# Altium schematic sheet as14120_ddr.SchDoc
size A3; PageSetup: Record=PageOptions|CenterHorizontal=True|CenterVertical=True|PrintScale=1.56|XCorrection=1.00|YCorrection=1.00|PrintKind=0|BorderSize=5000000|LeftOffset=0|BottomOffset=0|Orientation=2|PaperLength=3060|PaperWidth=2190|Scale=100|PaperSource=7|PrintQuality=-4|MediaType=1|DitherType=10|PaperKind=A4 (без полей) (210 x 297 мм)|PrintScaleMode=1
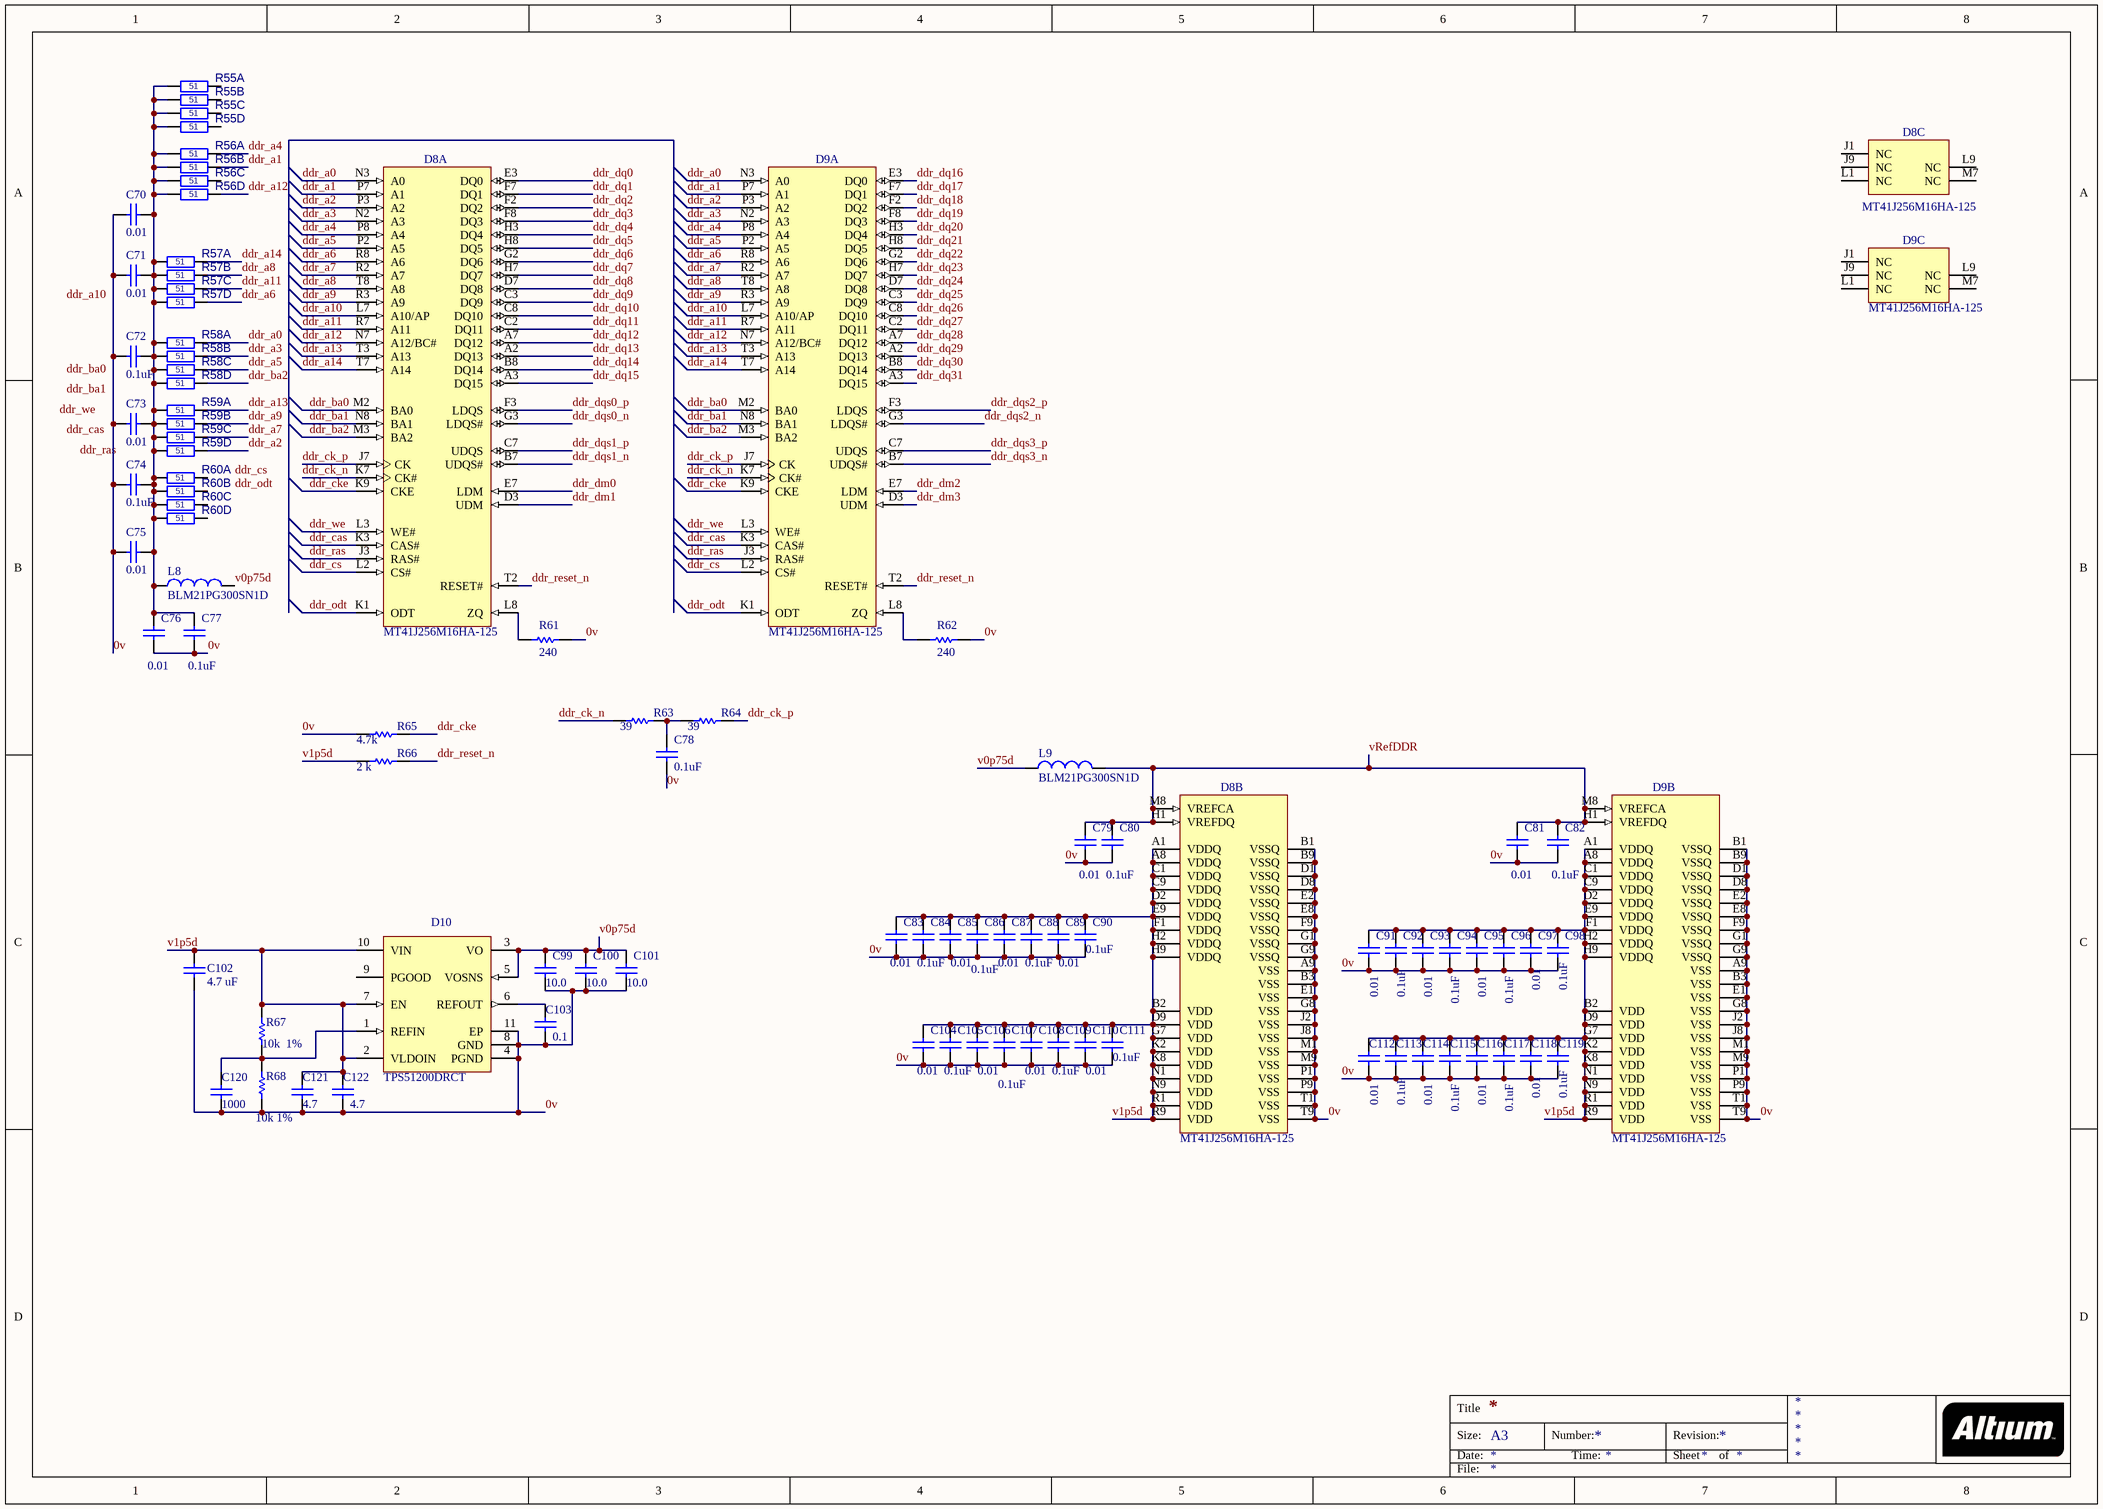
[diagram p0: as14120_ddr.SchDoc]

## Parts
C70  value 0.01  [CAPC0402(1005)60_M]  (hidden comment: CAP 1uF 10V 0402(1005))
C71  value 0.01  [CAPC0402(1005)60_M]  (hidden comment: CAP 1uF 10V 0402(1005))
C72  value 0.1uF  [CAPC0402(1005)60_M]  (hidden comment: CAP 1uF 10V 0402(1005))
C73  value 0.01  [CAPC0402(1005)60_M]  (hidden comment: CAP 1uF 10V 0402(1005))
C74  value 0.1uF  [CAPC0402(1005)60_M]  (hidden comment: CAP 1uF 10V 0402(1005))
C75  value 0.01  [CAPC0402(1005)60_M]  (hidden comment: CAP 1uF 10V 0402(1005))
C76  value 0.01  [CAPC0402(1005)60_M]  (hidden comment: CAP 1uF 10V 0402(1005))
C77  value 0.1uF  [CAPC0402(1005)60_M]  (hidden comment: CAP 1uF 10V 0402(1005))
C78  value 0.1uF  [CAPC0402(1005)60_M]  (hidden comment: CAP 1uF 10V 0402(1005))
C79  value 0.01  [CAPC0402(1005)60_M]  (hidden comment: CAP 1uF 10V 0402(1005))
C80  value 0.1uF  [CAPC0402(1005)60_M]  (hidden comment: CAP 1uF 10V 0402(1005))
C81  value 0.01  [CAPC0402(1005)60_M]  (hidden comment: CAP 1uF 10V 0402(1005))
C82  value 0.1uF  [CAPC0402(1005)60_M]  (hidden comment: CAP 1uF 10V 0402(1005))
C83  value 0.01  [CAPC0402(1005)60_M]  (hidden comment: CAP 1uF 10V 0402(1005))
C84  value 0.1uF  [CAPC0402(1005)60_M]  (hidden comment: CAP 1uF 10V 0402(1005))
C85  value 0.01  [CAPC0402(1005)60_M]  (hidden comment: CAP 1uF 10V 0402(1005))
C86  value 0.1uF  [CAPC0402(1005)60_M]  (hidden comment: CAP 1uF 10V 0402(1005))
C87  value 0.01  [CAPC0402(1005)60_M]  (hidden comment: CAP 1uF 10V 0402(1005))
C88  value 0.1uF  [CAPC0402(1005)60_M]  (hidden comment: CAP 1uF 10V 0402(1005))
C89  value 0.01  [CAPC0402(1005)60_M]  (hidden comment: CAP 1uF 10V 0402(1005))
C90  value 0.1uF  [CAPC0402(1005)60_M]  (hidden comment: CAP 1uF 10V 0402(1005))
C91  value 0.01  [CAPC0402(1005)60_M]  (hidden comment: CAP 1uF 10V 0402(1005))
C92  value 0.1uF  [CAPC0402(1005)60_M]  (hidden comment: CAP 1uF 10V 0402(1005))
C93  value 0.01  [CAPC0402(1005)60_M]  (hidden comment: CAP 1uF 10V 0402(1005))
C94  value 0.1uF  [CAPC0402(1005)60_M]  (hidden comment: CAP 1uF 10V 0402(1005))
C95  value 0.01  [CAPC0402(1005)60_M]  (hidden comment: CAP 1uF 10V 0402(1005))
C96  value 0.1uF  [CAPC0402(1005)60_M]  (hidden comment: CAP 1uF 10V 0402(1005))
C97  value 0.01  [CAPC0402(1005)60_M]  (hidden comment: CAP 1uF 10V 0402(1005))
C98  value 0.1uF  [CAPC0402(1005)60_M]  (hidden comment: CAP 1uF 10V 0402(1005))
C99  value 10.0  [CAPC0805(2012)100_N]  (hidden comment: CAP_0805)
C100  value 10.0  [CAPC0805(2012)100_N]  (hidden comment: CAP_0805)
C101  value 10.0  [CAPC0805(2012)100_N]  (hidden comment: CAP_0805)
C102  value 4.7 uF  [CAPC0805(2012)100_N]  (hidden comment: CAP_0805)
C103  value 0.1  [CAPC0805(2012)100_N]  (hidden comment: CAP_0805)
C104  value 0.01  [CAPC0402(1005)60_M]  (hidden comment: CAP 1uF 10V 0402(1005))
C105  value 0.1uF  [CAPC0402(1005)60_M]  (hidden comment: CAP 1uF 10V 0402(1005))
C106  value 0.01  [CAPC0402(1005)60_M]  (hidden comment: CAP 1uF 10V 0402(1005))
C107  value 0.1uF  [CAPC0402(1005)60_M]  (hidden comment: CAP 1uF 10V 0402(1005))
C108  value 0.01  [CAPC0402(1005)60_M]  (hidden comment: CAP 1uF 10V 0402(1005))
C109  value 0.1uF  [CAPC0402(1005)60_M]  (hidden comment: CAP 1uF 10V 0402(1005))
C110  value 0.01  [CAPC0402(1005)60_M]  (hidden comment: CAP 1uF 10V 0402(1005))
C111  value 0.1uF  [CAPC0402(1005)60_M]  (hidden comment: CAP 1uF 10V 0402(1005))
C112  value 0.01  [CAPC0402(1005)60_M]  (hidden comment: CAP 1uF 10V 0402(1005))
C113  value 0.1uF  [CAPC0402(1005)60_M]  (hidden comment: CAP 1uF 10V 0402(1005))
C114  value 0.01  [CAPC0402(1005)60_M]  (hidden comment: CAP 1uF 10V 0402(1005))
C115  value 0.1uF  [CAPC0402(1005)60_M]  (hidden comment: CAP 1uF 10V 0402(1005))
C116  value 0.01  [CAPC0402(1005)60_M]  (hidden comment: CAP 1uF 10V 0402(1005))
C117  value 0.1uF  [CAPC0402(1005)60_M]  (hidden comment: CAP 1uF 10V 0402(1005))
C118  value 0.01  [CAPC0402(1005)60_M]  (hidden comment: CAP 1uF 10V 0402(1005))
C119  value 0.1uF  [CAPC0402(1005)60_M]  (hidden comment: CAP 1uF 10V 0402(1005))
C120  value 1000  [CAPC0805(2012)100_N]  (hidden comment: CAP_0805)
C121  value 4.7  [CAPC0805(2012)100_N]  (hidden comment: CAP_0805)
C122  value 4.7  [CAPC0805(2012)100_N]  (hidden comment: CAP_0805)
D8  MT41J256M16HA-125  [MICT-HA-96]  (parts A,B,C of 3)
D9  MT41J256M16HA-125  [MICT-HA-96]  (parts A,B,C of 3)
D10  TPS51200DRCT  [TI-DRC10-2400X1650TP_V]
L8  BLM21PG300SN1D  [CAPC0805(2012)100_N]
L9  BLM21PG300SN1D  [CAPC0805(2012)100_N]
R55  value 51  [CAY16]  (hidden comment: RES_CAY16)  (parts A,B,C,D of 4)
R56  value 51  [CAY16]  (hidden comment: RES_CAY16)  (parts A,B,C,D of 4)
R57  value 51  [CAY16]  (hidden comment: RES_CAY16)  (parts A,B,C,D of 4)
R58  value 51  [CAY16]  (hidden comment: RES_CAY16)  (parts A,B,C,D of 4)
R59  value 51  [CAY16]  (hidden comment: RES_CAY16)  (parts A,B,C,D of 4)
R60  value 51  [CAY16]  (hidden comment: RES_CAY16)  (parts A,B,C,D of 4)
R61  value 240  [RESC0805(2012)_L]  (hidden comment: 1K 1% 0805(2012))
R62  value 240  [RESC0805(2012)_L]  (hidden comment: 1K 1% 0805(2012))
R63  39  [RESC0805(2012)_L]
R64  39  [RESC0805(2012)_L]
R65  value 4.7k  [RESC0805(2012)_L]  (hidden comment: 1K 1% 0805(2012))
R66  value 2 k  [RESC0805(2012)_L]  (hidden comment: 1K 1% 0805(2012))
R67  value 10k  1%  [RESC0805(2012)_L]  (hidden comment: 1K 1% 0805(2012))
R68  value 10k 1%  [RESC0805(2012)_L]  (hidden comment: 1K 1% 0805(2012))

## Nets
0v: C70.2 C71.2 C72.2 C73.2 C74.2 C75.2 C76.1 C77.1 C78.1 C79.1 C80.1 C81.1 C82.1 C83.1 C84.1 C85.1 C86.1 C87.1 C88.1 C89.1 C90.1 C91.1 C92.1 C93.1 C94.1 C95.1 C96.1 C97.1 C98.1 C99.1 C100.1 C101.1 C102.1 C103.1 C104.1 C105.1 C106.1 C107.1 C108.1 C109.1 C110.1 C111.1 C112.1 C113.1 C114.1 C115.1 C116.1 C117.1 C118.1 C119.1 C120.1 C121.1 C122.1 D8.A9(VSS) D8.B1(VSSQ) D8.B3(VSS) D8.B9(VSSQ) D8.D1(VSSQ) D8.D8(VSSQ) D8.E1(VSS) D8.E2(VSSQ) D8.E8(VSSQ) D8.F9(VSSQ) D8.G1(VSSQ) D8.G8(VSS) D8.G9(VSSQ) D8.J2(VSS) D8.J8(VSS) D8.M1(VSS) D8.M9(VSS) D8.P1(VSS) D8.P9(VSS) D8.T1(VSS) D8.T9(VSS) D9.A9(VSS) D9.B1(VSSQ) D9.B3(VSS) D9.B9(VSSQ) D9.D1(VSSQ) D9.D8(VSSQ) D9.E1(VSS) D9.E2(VSSQ) D9.E8(VSSQ) D9.F9(VSSQ) D9.G1(VSSQ) D9.G8(VSS) D9.G9(VSSQ) D9.J2(VSS) D9.J8(VSS) D9.M1(VSS) D9.M9(VSS) D9.P1(VSS) D9.P9(VSS) D9.T1(VSS) D9.T9(VSS) D10.4(PGND) D10.8(GND) D10.11(EP) R61.2 R62.2 R65.1 R68.1
ddr_a0: D8.N3(A0) D9.N3(A0) R58.6
ddr_a1: D8.P7(A1) D9.P7(A1) R56.5
ddr_a2: D8.P3(A2) D9.P3(A2) R59.5
ddr_a3: D8.N2(A3) D9.N2(A3) R58.5
ddr_a4: D8.P8(A4) D9.P8(A4) R56.6
ddr_a5: D8.P2(A5) D9.P2(A5) R58.8
ddr_a6: D8.R8(A6) D9.R8(A6) R57.7
ddr_a7: D8.R2(A7) D9.R2(A7) R59.6
ddr_a8: D8.T8(A8) D9.T8(A8) R57.8
ddr_a9: D8.R3(A9) D9.R3(A9) R59.7
ddr_a10: D8.L7(A10/AP) D9.L7(A10/AP)
ddr_a11: D8.R7(A11) D9.R7(A11) R57.5
ddr_a12: D8.N7(A12/BC#) D9.N7(A12/BC#) R56.7
ddr_a13: D8.T3(A13) D9.T3(A13) R59.8
ddr_a14: D8.T7(A14) D9.T7(A14) R57.6
ddr_ba0: D8.M2(BA0) D9.M2(BA0)
ddr_ba1: D8.N8(BA1) D9.N8(BA1)
ddr_ba2: D8.M3(BA2) D9.M3(BA2) R58.7
ddr_cas: D8.K3(CAS#) D9.K3(CAS#)
ddr_ck_n: D8.K7(CK#) D9.K7(CK#) R63.1
ddr_ck_p: D8.J7(CK) D9.J7(CK) R64.2
ddr_cke: D8.K9(CKE) D9.K9(CKE) R65.2
ddr_cs: D8.L2(CS#) D9.L2(CS#)
ddr_dm0: D8.E7(LDM)
ddr_dm1: D8.D3(UDM)
ddr_dm2: D9.E7(LDM)
ddr_dm3: D9.D3(UDM)
ddr_dq0: D8.E3(DQ0)
ddr_dq1: D8.F7(DQ1)
ddr_dq2: D8.F2(DQ2)
ddr_dq3: D8.F8(DQ3)
ddr_dq4: D8.H3(DQ4)
ddr_dq5: D8.H8(DQ5)
ddr_dq6: D8.G2(DQ6)
ddr_dq7: D8.H7(DQ7)
ddr_dq8: D8.D7(DQ8)
ddr_dq9: D8.C3(DQ9)
ddr_dq10: D8.C8(DQ10)
ddr_dq11: D8.C2(DQ11)
ddr_dq12: D8.A7(DQ12)
ddr_dq13: D8.A2(DQ13)
ddr_dq14: D8.B8(DQ14)
ddr_dq15: D8.A3(DQ15)
ddr_dq16: D9.E3(DQ0)
ddr_dq17: D9.F7(DQ1)
ddr_dq18: D9.F2(DQ2)
ddr_dq19: D9.F8(DQ3)
ddr_dq20: D9.H3(DQ4)
ddr_dq21: D9.H8(DQ5)
ddr_dq22: D9.G2(DQ6)
ddr_dq23: D9.H7(DQ7)
ddr_dq24: D9.D7(DQ8)
ddr_dq25: D9.C3(DQ9)
ddr_dq26: D9.C8(DQ10)
ddr_dq27: D9.C2(DQ11)
ddr_dq28: D9.A7(DQ12)
ddr_dq29: D9.A2(DQ13)
ddr_dq30: D9.B8(DQ14)
ddr_dq31: D9.A3(DQ15)
ddr_dqs0_n: D8.G3(LDQS#)
ddr_dqs0_p: D8.F3(LDQS)
ddr_dqs1_n: D8.B7(UDQS#)
ddr_dqs1_p: D8.C7(UDQS)
ddr_dqs2_n: D9.G3(LDQS#)
ddr_dqs2_p: D9.F3(LDQS)
ddr_dqs3_n: D9.B7(UDQS#)
ddr_dqs3_p: D9.C7(UDQS)
ddr_odt: D8.K1(ODT) D9.K1(ODT)
ddr_ras: D8.J3(RAS#) D9.J3(RAS#)
ddr_reset_n: D8.T2(RESET#) D9.T2(RESET#) R66.2
ddr_we: D8.L3(WE#) D9.L3(WE#)
v0p75d: C99.2 C100.2 C101.2 D10.3(VO) D10.5(VOSNS) L8.2 L9.1
v1p5d: C83.2 C84.2 C85.2 C86.2 C87.2 C88.2 C89.2 C90.2 C91.2 C92.2 C93.2 C94.2 C95.2 C96.2 C97.2 C98.2 C102.2 C104.2 C105.2 C106.2 C107.2 C108.2 C109.2 C110.2 C111.2 C112.2 C113.2 C114.2 C115.2 C116.2 C117.2 C118.2 C119.2 C121.2 C122.2 D8.A1(VDDQ) D8.A8(VDDQ) D8.B2(VDD) D8.C1(VDDQ) D8.C9(VDDQ) D8.D2(VDDQ) D8.D9(VDD) D8.E9(VDDQ) D8.F1(VDDQ) D8.G7(VDD) D8.H2(VDDQ) D8.H9(VDDQ) D8.K2(VDD) D8.K8(VDD) D8.N1(VDD) D8.N9(VDD) D8.R1(VDD) D8.R9(VDD) D9.A1(VDDQ) D9.A8(VDDQ) D9.B2(VDD) D9.C1(VDDQ) D9.C9(VDDQ) D9.D2(VDDQ) D9.D9(VDD) D9.E9(VDDQ) D9.F1(VDDQ) D9.G7(VDD) D9.H2(VDDQ) D9.H9(VDDQ) D9.K2(VDD) D9.K8(VDD) D9.N1(VDD) D9.N9(VDD) D9.R1(VDD) D9.R9(VDD) D10.2(VLDOIN) D10.7(EN) D10.10(VIN) R66.1 R67.2
vRefDDR: C79.2 C80.2 C81.2 C82.2 D8.H1(VREFDQ) D8.M8(VREFCA) D9.H1(VREFDQ) D9.M8(VREFCA) L9.2
NetC70_1: C70.1 C71.1 C72.1 C73.1 C74.1 C75.1 C76.2 C77.2 L8.1 R55.1 R55.2 R55.3 R55.4 R56.1 R56.2 R56.3 R56.4 R57.1 R57.2 R57.3 R57.4 R58.1 R58.2 R58.3 R58.4 R59.1 R59.2 R59.3 R59.4 R60.1 R60.2 R60.3 R60.4
NetC78_2: C78.2 R63.2 R64.1
NetC103_2: C103.2 D10.6(REFOUT)
NetC120_2: C120.2 D10.1(REFIN) R67.1 R68.2
NetD8_L8: D8.L8(ZQ) R61.1
NetD9_L8: D9.L8(ZQ) R62.1

Not connected (* = marked no-connect by the designer): D8 J1(NC) J9(NC) L1(NC) L9(NC) M7(NC); D9 J1(NC) J9(NC) L1(NC) L9(NC) M7(NC); D10 9(PGOOD); R55 5(2) 6(2) 7(2) 8(2); R56 8(2); R60 5(2) 6(2) 7(2) 8(2)

## Notes on the sheet
- Labels drawn without touching a wire or pin: ddr_a10, ddr_ba0, ddr_ba1, ddr_cas, ddr_cs, ddr_odt, ddr_ras, ddr_we
- Title
- Size:
- Date:
- A3
- Number:
- Time:
- Revision:
- Sheet
- of
- File:

## Library data of the parts
C70-C98 C104-C119 = CAP_0402: CAP 1uF 10V ±20% 0402 (1005 Metric) Thickness 0.6mm SMD; Case-Metric: 1005; Case-EIA: 0402; Tolerance: ±20%; Max Thickness: 0.6 mm; Rated Voltage: 10 V; Technology: SMT
D8 D9 = MT41J256M16HA-125: 4Gb DDR3-1600 SDRAM, 256Mb x 16, 1.25ns, 1.5V, 0 to 95 degC, 96-Ball FBGA, Pb-Free; Manufacturer: Micron; CL: CL = 11; Clock Rate: 800 MHz; Op. Temp.: 0C to +95C; DatasheetVersion: Rev.J; PackageVersion: Rev.E; PackageReference: MICT-HA-96; PackageDescription: 96-Ball Fine-Pitch Ball Grid Array, 14 x 9 mm, Pitch 0.8 mm; Cycle Time: 1.25ns; Data Rate: DDR3-1600; Density: 4Gb; Depth: 256Mb; Package: FBGA; Pin Count: 96-ball; RoHS: Yes; Voltage: 1.5V; Width: x16; Mounting Technology: Surface Mount; PartNumber: MT41J256M16HA-125; ComponentLink1Description: Manufacturer URL; ComponentLink1URL: http://www.micron.com/; ComponentLink2Description: Datasheet; ComponentLink2URL: http://www.micron.com/~/media/Documents/Products/Data%20Sheet/DRAM/4Gb_DDR3_SDRAM.pdf; ComponentLink3Description: Package Specification; ComponentLink3URL: http://www.micron.com/~/media/Documents/Products/Data%20Sheet/DRAM/4Gb_1_35V_DDR3L.pdf
D10 = TPS51200DRCT: Single Output LDO, 3 A, 2.375 to 3.5 V Input, with DDR Termination, 10-pin SON (DRC), -40 to 85 degC, Green (RoHS & no Sb/Br); Manufacturer: Texas Instruments; Iout(Max)(A): 3; Iq(Typ)(mA): 0.5; Power Good: TRUE; Rating: Catalog; SubFamily: Single Channel LDO; Vin(Max)(V): 3.5; Vin(Min)(V): 2.3; DatasheetVersion: SLUS812; PackageVersion: 4204102-3/L; PackageReference: DRC10-2400X1650TP; PackageDescription: 10-Pin Plastic Small Outline, Body 3 x 3 mm, Pitch 0.5 mm; Supplier 1: Digi-Key; Supplier Part Number 1: 296-23830-2-ND; Supplier 2: Digi-Key; Supplier Part Number 2: 296-23830-1-ND; Supplier 3: Digi-Key; Supplier Part Number 3: 296-23830-6-ND; Supplier 4: Farnell; Supplier Part Number 4: 1903398; Supplier 5: Newark; Supplier Part Number 5: 01P3287; Supplier 6: Newark; Supplier Part Number 6: 11N9833; Supplier 7: Mouser; Supplier Part Number 7: 595-TPS51200DRCT; Eco-Plan: Green (RoHS & no Sb/Br); Mounting Technology: Surface Mount; PartNumber: TPS51200DRCT; ComponentLink1Description: Manufacturer URL; ComponentLink1URL: http://www.ti.com/; ComponentLink2Description: Datasheet; ComponentLink2URL: http://www.ti.com/general/docs/lit/getliterature.tsp?genericPartNumber=TPS51200&fileType=pdf; ComponentLink3Description: Package Specification; ComponentLink3URL: http://www.ti.com/litv/pdf/mpds117k; ComponentLink4Description: URL Link1; ComponentLink4URL: Samples URL:http://www.ti.com/product/tps51200#samples
L8 L9 = Ferrite_beat
R61-R68 = RES_0805: 1K 0.125W 1% 0805 (2012 Metric)  SMD; Case-Metric: 2012; Case-EIA: 0805; Tolerance: 1 %; Power: 0.125 W; Technology: SMT
  R63 R64: Value: 39